# EAGLE design driver relay ckt (EAGLE 6.3)
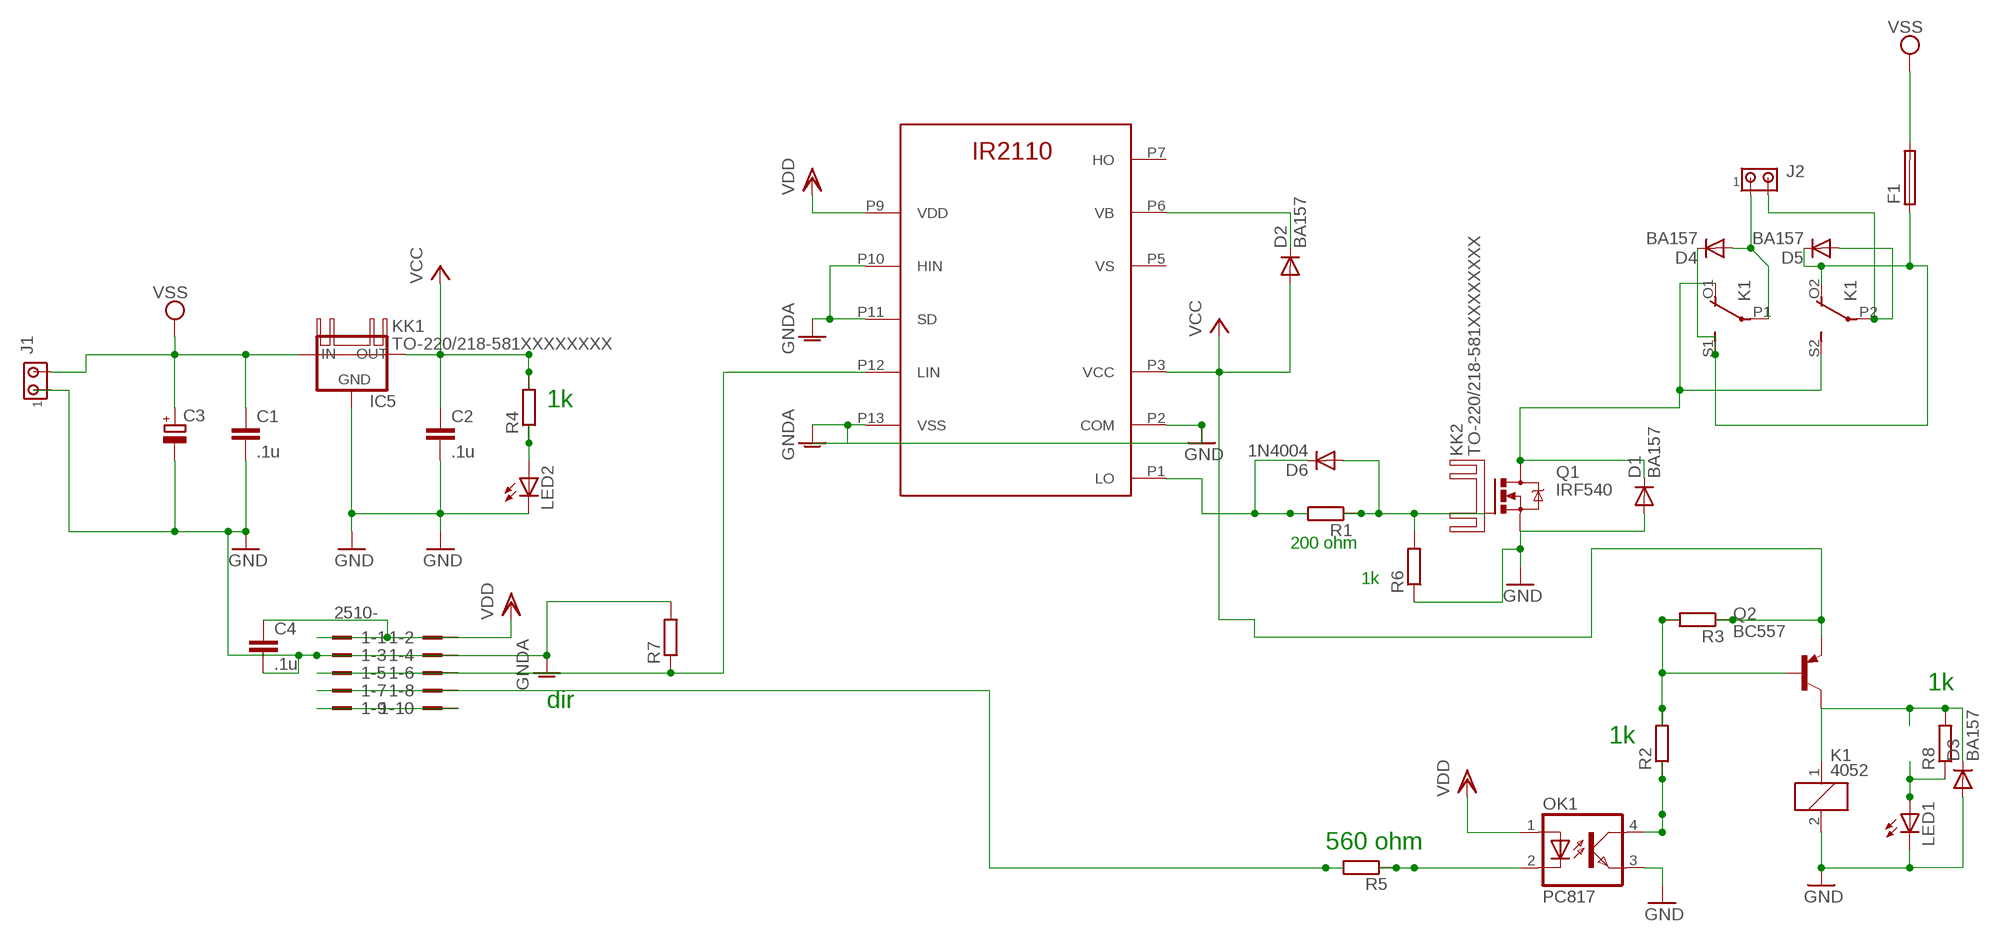
[diagram p0: schematic, sheet 1]

## Parts
1  2510-  [PAK100/2500-10]
C1  .1u  C2,5-3  [C2.5-3]
C2  .1u  C2,5-3  [C2.5-3]
C3  CPOL-EUE7.5-16  [E7,5-16]
C4  .1u  C2,5-3  [C2.5-3]
D1  BA157  [P1-10]
D2  BA157  [P1-10]
D3  BA157  [P1-10]
D4  BA157  [P1-10]
D5  BA157  [P1-10]
D6  1N4004  [DO41-10]
F1  SH22,5A  [SH22,5A]
IC5  78XXS  [78XXS]
J1  MTA02-156  [1X2MTA]
J2  MTA02-156  [1X2MTA]
K1  4052  [F4052]
KK1  TO-220/218-581XXXXXXXX  [581XXXXXXXX]
KK2  TO-220/218-581XXXXXXXX  [581XXXXXXXX]
LED1  LEDSFH482  [SFH482]
LED2  LEDSFH482  [SFH482]
OK1  PC817  [DIL04]
Q1  IRF540  [TO220BV]
Q2  BC557  [TO92-EBC]
R1  R-EU_0207/10  [0207/10]
R2  R-EU_0207/10  [0207/10]
R3  R-EU_0207/10  [0207/10]
R4  R-EU_0207/10  [0207/10]
R5  R-EU_0207/10  [0207/10]
R6  R-EU_0207/10  [0207/10]
R7  R-EU_0207/10  [0207/10]
R8  R-EU_0207/10  [0207/10]
U$1  IR2110N  [DIL14-1]

## Nets
GND: C2.2 D1.A D3.A IC5.GND K1.2 LED1.K(C) LED2.K(C) OK1.3(EMIT) Q1.S R6.1 U$1.P2(COM) U$1.P13(VSS) ; supply symbol labelled GNDA
GNDA: 1.3 1.4 C1.2 C3.- C4.2 J1.1 R7.2 U$1.P10(HIN) U$1.P11(SD) ; supply symbol labelled GND
N$1: D6.C R1.2 U$1.P1(LO)
N$2: D6.A Q1.G R1.1 R6.2
N$3: D2.C U$1.P6(VB)
N$4: LED1.A R8.1
N$5: D1.C K1.O1(2:O) K1.S2(3:S) Q1.D
N$6: 1.9 1.10
N$7: 1.5 1.6 R7.1 U$1.P12(LIN)
N$8: 1.7 1.8 R5.2
N$9: C2.1 D2.A IC5.OUT Q2.E R3.1 R4.2 U$1.P3(VCC) ; supply symbol labelled VCC
N$10: D5.A J2.2 K1.P2(3:P)
N$11: D4.C D5.C F1.1 K1.O2(3:O) K1.S1(2:S)
N$13: D3.C K1.1 Q2.C R8.2
N$14: Q2.B R2.2 R3.2
N$15: OK1.4(COL) R2.1
N$16: LED2.A R4.1
N$17: OK1.2(C) R5.1
N$18: D4.A J2.1 K1.P1(2:P)
VDD: 1.1 1.2 C4.1 OK1.1(A) U$1.P9(VDD)
VSS: C1.1 C3.+ F1.2 IC5.IN J1.2
Unconnected: U$1.P5(VS) U$1.P7(HO)

## Notes on the sheet
- 1k
- 200 ohm
- 1k
- 1k
- dir
- 1k
- 560 ohm

## Library data of the parts
1 = con-3m:2510-: 3M (TM) Pak 100 4-Wall Header Source: 3M
C1 C2 C4 = capacitor-wima:C: CAPACITOR naming: grid - package width
C3 = qfm-trx1-24g:CPOL-EU: POLARIZED CAPACITOR, European symbol
D1-D5 = diode:BA157: DIODE fast soft-recovery controlled avalanche rectifier
D6 = diode-1:1N4004: DIODE general purpose rectifier, 1 A
F1 = fuse:SH22,5A: FUSE HOLDER grid 22,5mm, isolated cap OGN0031 8201, Schurter (Buerklin)
IC5 = v-reg:78XXS: VOLTAGE REGULATOR
J1 J2 = con-amp:MTA02-156: AMP connector
K1 = relay:4052: RELAY 2 x switch, Finder
KK1 KK2 = heatsink-aavid:TO-220/218: HEATSINKS TO-220/218
LED1 LED2 = led:LED: LED OSRAM: - CHIPLED LG R971, LG N971, LY N971, LG Q971, LY Q971, LO R971, LY R971 LH N974, LH R974 LS Q976, LO Q976, LY Q976 LO Q996 - Hyper CHIPLED LW Q18S LB Q993, LB Q99A, LB R99A - SideLED LS A670, LO A670, LY A670, LG A670, LP A670 LB A673, LV A673, LT A673, LW A673 LH A674 LY A675 LS A676, LA A676, LO A676, LY A676, LW A676 LS A679, LY A679, LG A679 - Hyper Micro SIDELED® LS Y876, LA Y876, LO Y876, LY Y876 LT Y87S - SmartLED LW L88C, LW L88S LB L89C, LB L89S, LG L890 LS L89K, LO L89K, LY L89K LS L896, LA L896, LO L896, LY L896 - TOPLED LS T670, LO T670, LY T670, LG T670, LP T670 LSG T670, LSP T670, LSY T670, LOP T670, LYG T670 LG T671, LOG T671, LSG T671 LB T673, LV T673, LT T673, LW T673 LH T674 LS T676, LA T676, LO T676, LY T676, LB T676, LH T676, LSB T676, LW T676 LB T67C, LV T67C, LT T67C, LS T67K, LO T67K, LY T67K, LW E67C LS E67B, LA E67B, LO E67B, LY E67B, LB E67C, LV E67C, LT E67C LW T67C LS T679, LY T679, LG T679 LS T770, LO T770, LY T770, LG T770, LP T770 LB T773, LV T773, LT T773, LW T773 LH T774 LS E675, LA E675, LY E675, LS T675 LS T776, LA T776, LO T776, LY T776, LB T776 LHGB T686 LT T68C, LB T68C - Hyper Mini TOPLED® LB M676 - Mini TOPLED Santana® LG M470 LS M47K, LO M47K, LY M47K Source: http://www.osram.convergy.de LUXEON: - LUMILED® LXK2-PW12-R00, LXK2-PW12-S00, LXK2-PW14-U00, LXK2-PW14-V00 LXK2-PM12-R00, LXK2-PM12-S00, LXK2-PM14-U00 LXK2-PE12-Q00, LXK2-PE12-R00, LXK2-PE12-S00, LXK2-PE14-T00, LXK2-PE14-U00 LXK2-PB12-K00, LXK2-PB12-L00, LXK2-PB12-M00, LXK2-PB14-N00, LXK2-PB14-P00, LXK2-PB14-Q00 LXK2-PR12-L00, LXK2-PR12-M00, LXK2-PR14-Q00, LXK2-PR14-R00 LXK2-PD12-Q00, LXK2-PD12-R00, LXK2-PD12-S00 LXK2-PH12-R00, LXK2-PH12-S00 LXK2-PL12-P00, LXK2-PL12-Q00, LXK2-PL12-R00 Source: www.luxeon.com KINGBRIGHT: KA-3528ASYC Source: www.kingbright.com
OK1 = optocoupler:PC817: SHARP OPTO COUPLER
Q1 = transistor-power:IRF540: HEXFET Power MOSFET
Q2 = transistor-pnp:BC557*: PNP Transistror
R1-R8 = resistor:R-EU_: RESISTOR, European symbol
U$1 = jfw-pwm1:IR2110

## Board
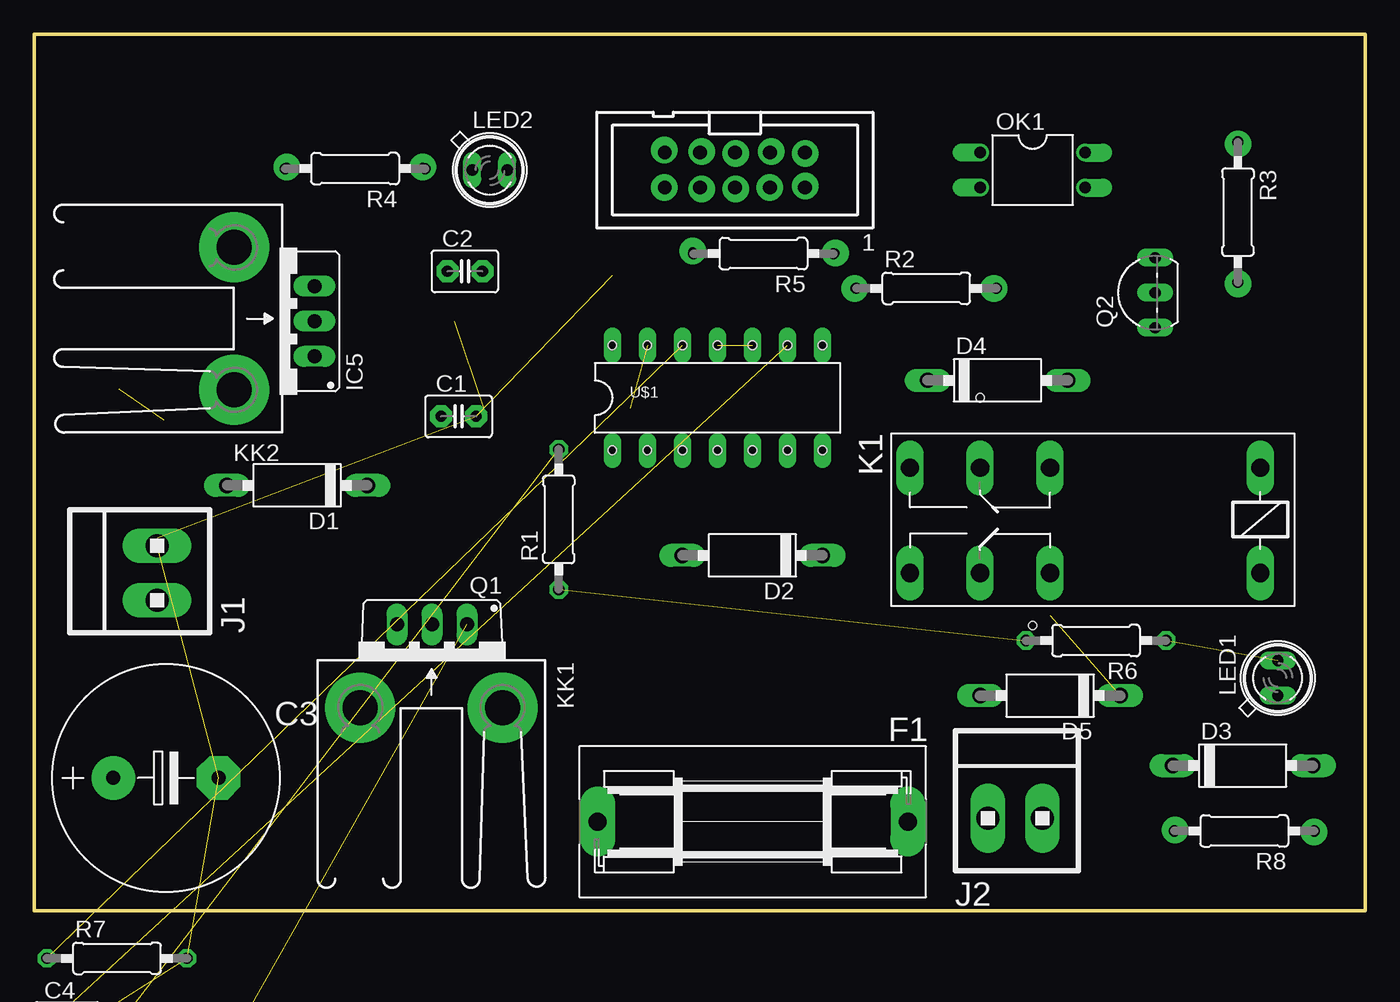
[diagram p1: board, top side]
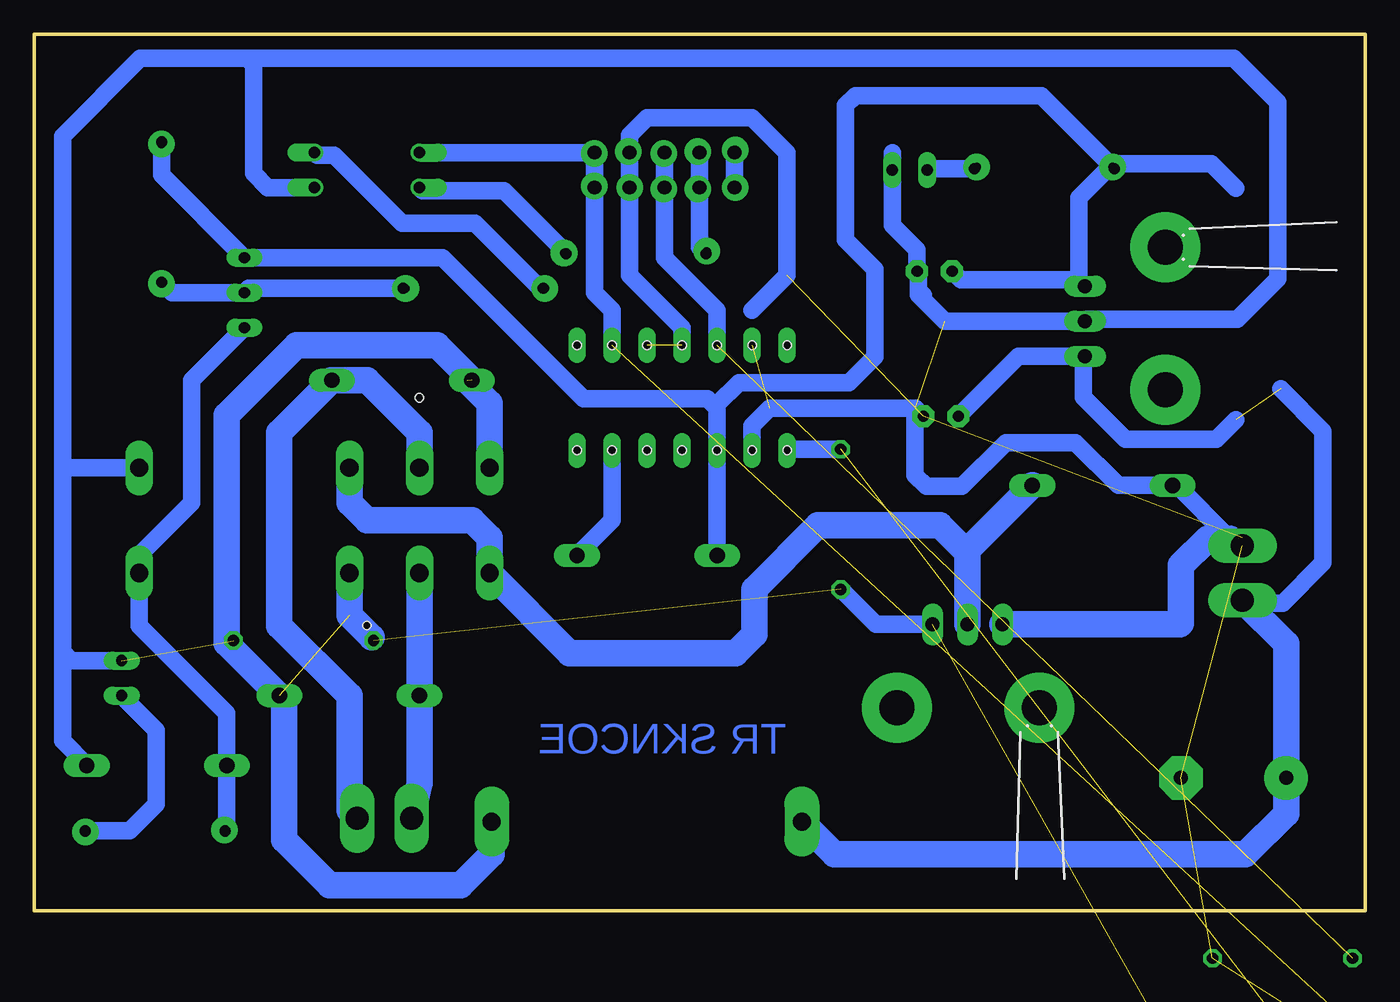
[diagram p2: board, bottom side, seen from below]

Size 96.5 x 63.53 mm. Coordinates in mm from the lower left corner, seen from the top.
Outline: 0,0 96.5,0 96.5,63.53 0,63.53 0,0
Copper layers (1*16): Top 0.035mm / dielectric 1.5mm / Bottom 0.035mm
Design rules "default": minimum track width 30mil, minimum drill 24mil, track to track 10mil, track to pad 10mil, pad to pad 10mil, via to via 10mil, smd to smd 8mil, copper to edge 40mil, drill to drill 8mil, minimum pad ring 10mil, minimum via ring 8mil, stop-mask expansion 4mil, vias tented up to drill 0mil, thermal gap 10mil
Holes 0.6 mm at 68.58,37.19 72.39,20.68

### Footprints (pad centres in the part's own frame; a part is rotated, then mirrored left to right if it is on the bottom)
PAK100/2500-10 = drill 1 pad 1.422: 1 -5.08,-1.27; 2 -5.08,1.27; 3 -2.54,-1.27; 4 -2.54,1.27; 5 0,-1.27; 6 0,1.27; 7 2.54,-1.27; 8 2.54,1.27; 9 5.08,-1.27; 10 5.08,1.27
C2.5-3 = drill 0.813 pad 1.6 octagon: 1 -1.27,0; 2 1.27,0
E7,5-16 = drill 1.016 pad 3.15: + -3.81,0 | drill 1.016 pad 3.15 octagon: - 3.81,0
P1-10 = drill 1.118 long: A 5.08,0; C -5.08,0
DO41-10 = drill 1.118 pad 1.93: A 5.08,0; C -5.08,0
SH22,5A = drill 1.321 pad 2.54 long: 1 -11.252,0; 2 11.252,0
78XXS = drill 1.016 long: GND 0,-2.54; IN -2.54,-2.54; OUT 2.54,-2.54
1X2MTA = drill 1.676 long: 1 1.981,0; 2 -1.981,0
F4052 = drill 1.321 long: 1 -3.81,3.81; 2 -3.81,-3.81; O1 11.43,-3.81; O2 11.43,3.81; P1 16.51,-3.81; P2 16.51,3.81; S1 21.59,-3.81; S2 21.59,3.81
581XXXXXXXX = drill 2.54 pad 5.08: A2,5 -5.16,3.45; B2,5 5.16,3.45
SFH482 = drill 0.813 long: A -1.27,0; K 1.27,0
DIL04 = drill 0.813 offset: 1 -1.27,-3.81; 2 1.27,-3.81; 3 1.27,3.81; 4 -1.27,3.81
TO220BV = drill 1.016 long: D 0,-2.54; G -2.54,-2.54; S 2.54,-2.54
TO92-EBC = drill 0.813 long: B 0,-1.27; C -2.54,-1.27; E 2.54,-1.27
0207/10 = drill 0.813 octagon: 1 -5.08,0; 2 5.08,0
DIL14-1 = drill 0.406 pad 1.27 long: P1 -8.89,-3.81; P2 -6.35,-3.81; P3 -3.81,-3.81; P4 -1.27,-3.81; P5 1.27,-3.81; P6 3.81,-3.81; P7 6.35,-3.81; P8 6.35,3.81; P9 3.81,3.81; P10 1.27,3.81; P11 -1.27,3.81; P12 -3.81,3.81; P13 -6.35,3.81; P14 -8.89,3.81 | hole 0.61: -8.89,-3.81; -6.35,-3.81; -3.81,-3.81; -1.27,-3.81; 1.27,-3.81; 3.81,-3.81; 6.35,-3.81; 6.35,3.81; 3.81,3.81; 1.27,3.81; -1.27,3.81; -3.81,3.81; -6.35,3.81; -8.89,3.81

### Placement (x,y rotation side)
1  50.8,53.7 180 top
C1  30.76,35.84 0 top
C2  31.22,46.36 0 top
C3  9.54,9.63 0 top
C4  2.36,-8.15 0 top  (outside the outline)
D1  19.05,30.84 180 top
D2  52.07,25.76 180 top
D3  87.63,10.52 0 top
D4  69.85,38.46 0 top
D5  73.66,15.6 180 top
D6  6.02,-15.06 0 top  (outside the outline)
F1  52.1,6.45 180 top
IC5  17.77,42.74 90 top
J1  8.89,24.49 90 top
J2  71.12,6.71 0 top
K1  85.09,28.3 180 top
KK1  28.79,18.17 180 top
KK2  17.95,42.93 90 top
LED1  90.17,16.87 90 top
LED2  33.02,53.7 0 top
OK1  72.39,53.7 270 top
Q1  28.83,18.21 180 top
Q2  80.01,44.81 90 top
R1  38.02,28.37 90 top
R2  64.68,45.12 0 top
R3  87.27,50.65 270 top
R4  23.25,53.8 180 top
R5  52.87,47.64 180 top
R6  76.99,19.58 180 top
R7  5.98,-3.45 0 top  (outside the outline)
R8  87.74,5.78 180 top
U$1  50.8,37.19 0 top

### Tracks (layer width: path | path; a pad name or v marks a point on that pad's centre or on a via)
GND  (3 unrouted)
  Bottom 1.27: 88.9,33.38 K1.2 94.41,32.11 94.46,32.05 | 34.29,54.97 LED2.K 34.26,53.67 34.26,49.69 32.49,47.92 C2.2 32.38,46.25 32.38,44.98 | 9.4,26.97 9.79,26.97 13.65,30.84 D1.A 17.91,30.84 21.01,33.93 26.05,33.93 29.22,30.76 31.8,30.76 32.63,31.58 32.63,35.94 32.38,36.19 32.6,36.41 43.18,36.41 44.45,35.14 U$1.P2 | 13.42,20.75 13.35,20.83 | 32.38,44.98 32.38,44.64 30.48,42.74 IC5.GND 20.17,42.87 9.27,42.87 6.34,45.81 6.34,58.62 9.51,61.8 81.08,61.8 | 32.03,44.63 32.38,44.98 | D3.A 92.71,10.55 94.46,12.31 94.46,18.77 | 94.46,18.77 94.46,32.05 | 94.46,32.05 94.46,56.16 88.82,61.8 81.08,61.8 | OK1.3 79.59,52.43 80.62,53.45 80.62,61.34 81.08,61.8 | LED1.K 93.83,18.14 94.46,18.77
  Bottom 1.93: 13.35,20.83 13.35,25.04 11.42,26.97 9.79,26.97 | Q1.S 13.42,20.75
GNDA  (6 unrouted)
  Bottom 1.27: U$1.P11 49.53,42.27 53.34,46.08 1.4 1.3 53.34,56.24 52.07,57.51 44.45,57.51 41.91,54.97 41.91,46.08 44.45,43.54 | 8.89,27.03 J1.1
N$1  (1 unrouted)
  Bottom 1.27: R1.2 41.83,33.45 U$1.P1
N$2  (2 unrouted)
  Bottom 1.27: Q1.G 35.48,20.75 R1.1
N$3
  Bottom 1.27: U$1.P6 54.61,28.3 D2.C
N$4
  Bottom 1.27: R8.1 89.61,5.78 87.67,7.72 87.67,13.09 LED1.A
N$5
  Bottom 1.27: 28.83,25.95 28.83,26.14
  Bottom 1.93: K1.O1 73.66,29.57 72.39,28.3 64.77,28.3 63.5,27.03 K1.S2 57.7,18.68 45.66,18.68 44.3,20.04 44.3,23.3 39.66,27.94 30.82,27.94 28.83,25.95 Q1.D | 28.83,26.14 D1.C
N$6
  Bottom 1.27: 1.10 1.9
N$7  (1 unrouted)
  Bottom 1.27: 1.5 1.6 50.8,47.35 46.99,43.54 U$1.P12
N$8
  Bottom 1.27: 1.7 1.8 48.26,48.11 R5.2
N$9
  Bottom 1.27: D2.A U$1.P3 46.99,36.41 | R3.1 87.27,53.34 Q2.E 66.92,47.35 56.68,37.11 47.69,37.11 46.99,36.41 | R4.2 18.66,53.8 20.76,51.69 20.76,45.73 | 20.76,45.73 IC5.OUT | 20.76,45.73 29.32,45.73 C2.1 | 46.99,36.41 46.99,36.72 45.42,38.29 37.44,38.29 35.56,40.17 35.56,46.52 37.67,48.63 37.67,58.38 36.96,59.09 23.47,59.09 R4.2 | 9.36,52.37 11.15,54.17 17.81,54.17 R4.2
N$10
  Bottom 1.93: J2.2 68.58,9.25 D5.A K1.P2
N$11  (2 unrouted)
  Bottom 1.27: 78.38,15.24 D5.C
  Bottom 1.93: K1.S1 63.5,36.78 65.13,38.4 | D4.C 67.31,41 77.47,41 82.55,35.92 82.55,19.41 D5.C | K1.O2 73.66,21.44 72.05,19.82 | F1.1 63.35,4.09 65.6,1.84 75.09,1.84 78.38,5.13 78.38,15.24
N$13
  Bottom 1.27: Q2.C 85.09,38.46 85.09,29.57 88.9,25.76 K1.1 88.9,20.68 82.55,14.33 D3.C 82.55,5.89 R8.2
N$14
  Bottom 1.27: R2.2 80.96,45.12 Q2.B 86.51,44.81 R3.2
N$15
  Bottom 1.27: 77.47,54.97 OK1.4 76,54.76 74.76,54.76 69.84,49.83 64.53,49.83 59.82,45.12 R2.1
N$16
  Bottom 1.27: R4.1 31.65,53.8 LED2.A
N$17
  Bottom 1.27: R5.1 57.95,47.71 62.45,52.21 68.36,52.21 OK1.2
N$18
  Bottom 1.27: 78.74,32.11 78.74,33.38
  Bottom 1.93: K1.P1 68.58,34.65 72.39,38.46 D4.A 78.74,34.65 78.74,32.11 78.74,20.68 73.66,15.6 73.66,7.26 J2.1
N$20  (via drill 0.6 pad 1.93)
  other vias: 45.68,55.14
N$21  (via drill 0.6 pad 1.93)
  other vias: 48.39,55.03
N$22  (via drill 0.6 pad 1.93)
  other vias: 50.85,54.9
N$23  (via drill 0.6 pad 1.93)
  other vias: 53.44,55.03
N$24  (via drill 0.6 pad 1.93)
  other vias: 55.91,54.9
N$25  (via drill 0.6 pad 1.93)
  other vias: 55.91,52.55
N$26  (via drill 0.6 pad 1.93)
  other vias: 53.33,52.44
N$27  (via drill 0.6 pad 1.93)
  other vias: 50.85,52.32
N$28  (via drill 0.6 pad 1.93)
  other vias: 48.39,52.32
N$29  (via drill 0.6 pad 1.93)
  other vias: 45.68,52.44
N$32  (via drill 0.6 pad 1.93)
  other vias: 82.73,5.84
N$33  (via drill 0.6 pad 1.93)
  other vias: 92.81,5.71
N$34  (via drill 0.6 pad 1.93)
  other vias: 87.3,45.45
N$35  (via drill 0.6 pad 1.93)
  other vias: 87.3,55.58
N$36  (via drill 0.6 pad 1.93)
  other vias: 59.49,45.11
N$37  (via drill 0.6 pad 1.93)
  other vias: 69.58,45.11
N$38  (via drill 0.6 pad 1.93)
  other vias: 58.09,47.69
N$39  (via drill 0.6 pad 1.93)
  other vias: 47.75,47.82
N$40  (via drill 0.6 pad 1.93)
  other vias: 28.16,53.92
N$41  (via drill 0.6 pad 1.93)
  other vias: 18.3,53.92
VDD  (1 unrouted)
  Bottom 1.27: OK1.1 1.1 1.2 55.88,44.81 54.61,43.54 U$1.P9
VSS  (1 unrouted)
  Bottom 1.27: 6.12,37.83 3.05,34.76 3.05,25.23 5.98,22.3 8.69,22.3 J1.2 | C1.1 25.13,40.2 IC5.IN 20.42,40.08 20.42,37.22 17.37,34.18 10.79,34.18 9.36,35.61
  Bottom 1.93: F1.2 38.47,4.08 8.69,4.08 5.73,7.04 C3.+ 5.73,19.34 J1.2

### Text on the board
Bottom: TR SKNCOE